# EAGLE design Infinity Mirror_005 (EAGLE 7.3.0)
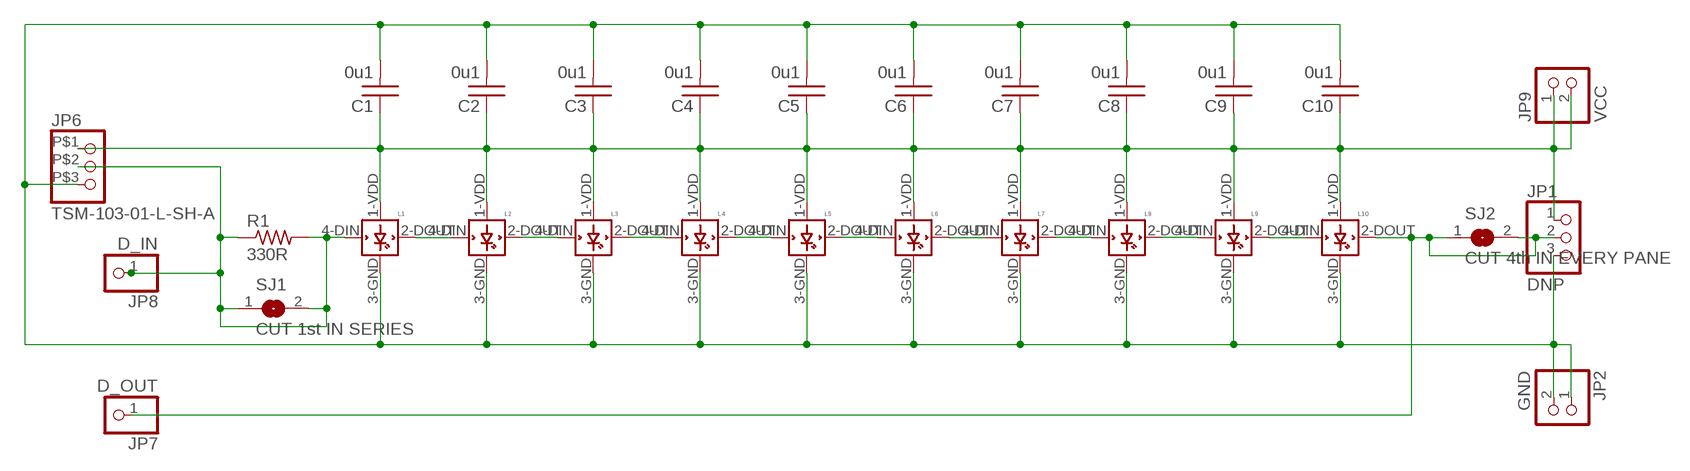
[diagram p0: schematic, sheet 1]

## Parts
C1  0u1  C-USC1206  [C1206]
C2  0u1  C-USC1206  [C1206]
C3  0u1  C-USC1206  [C1206]
C4  0u1  C-USC1206  [C1206]
C5  0u1  C-USC1206  [C1206]
C6  0u1  C-USC1206  [C1206]
C7  0u1  C-USC1206  [C1206]
C8  0u1  C-USC1206  [C1206]
C9  0u1  C-USC1206  [C1206]
C10  0u1  C-USC1206  [C1206]
JP1  DNP  PINHD-1X3CB  [1X03-CLEANBIG]
JP2  GND  PINHD-1X2  [1X02-CLEANBIG]
JP6  TSM-103-01-L-SH-A  [TSM-103-01-L-SH-A]
JP7  D_OUT  PINHD-1X1CB  [1X01-CLEANBIG]
JP8  D_IN  PINHD-1X1CB  [1X01-CLEANBIG]
JP9  VCC  PINHD-1X2  [1X02-CLEANBIG]
L1  WS2812B  [WS2812B]
L2  WS2812B  [WS2812B]
L3  WS2812B  [WS2812B]
L4  WS2812B  [WS2812B]
L5  WS2812B  [WS2812B]
L6  WS2812B  [WS2812B]
L7  WS2812B  [WS2812B]
L8  WS2812B  [WS2812B]
L9  WS2812B  [WS2812B]
L10  WS2812B  [WS2812B]
R1  330R  R-US_R1206  [R1206]
SJ1  CUT 1st IN SERIES  SJ  [SJ]
SJ2  CUT 4th IN EVERY PANE  SJ  [SJ]

## Nets
GND: C1.2 C2.2 C3.2 C4.2 C5.2 C6.2 C7.2 C8.2 C9.2 C10.2 JP1.3 JP2.1 JP2.2 JP6.P$3 L1.3-GND(GND) L2.3-GND(GND) L3.3-GND(GND) L4.3-GND(GND) L5.3-GND(GND) L6.3-GND(GND) L7.3-GND(GND) L8.3-GND(GND) L9.3-GND(GND) L10.3-GND(GND)
N$1: L2.2-DOUT(DOUT) L3.4-DIN(DIN)
N$2: L3.2-DOUT(DOUT) L4.4-DIN(DIN)
N$3: L4.2-DOUT(DOUT) L5.4-DIN(DIN)
N$4: L5.2-DOUT(DOUT) L6.4-DIN(DIN)
N$5: L6.2-DOUT(DOUT) L7.4-DIN(DIN)
N$6: L1.2-DOUT(DOUT) L2.4-DIN(DIN)
N$7: L7.2-DOUT(DOUT) L8.4-DIN(DIN)
N$8: L8.2-DOUT(DOUT) L9.4-DIN(DIN)
N$10: JP6.P$2 JP8.1 L1.4-DIN(DIN) R1.1 R1.2 SJ1.1 SJ1.2
N$12: L9.2-DOUT(DOUT) L10.4-DIN(DIN)
N$14: JP1.2 JP7.1 L10.2-DOUT(DOUT) SJ2.1 SJ2.2
VCC: C1.1 C2.1 C3.1 C4.1 C5.1 C6.1 C7.1 C8.1 C9.1 C10.1 JP1.1 JP6.P$1 JP9.1 JP9.2 L1.1-VDD(VDD) L2.1-VDD(VDD) L3.1-VDD(VDD) L4.1-VDD(VDD) L5.1-VDD(VDD) L6.1-VDD(VDD) L7.1-VDD(VDD) L8.1-VDD(VDD) L9.1-VDD(VDD) L10.1-VDD(VDD)

## Library data of the parts
C1-C10 = adafruit:C-US: CAPACITOR, American symbol
JP1 = adafruit:PINHD-1X3: PIN HEADER
JP2 JP9 = adafruit:PINHD-1X2
JP6 = AAA_Custom_Parts:TSM-103-01-L-SH-A
JP7 JP8 = adafruit:PINHD-1X1: Pin header 1x1 for 0.1" spacing With round pins
L1-L10 = adafruit:WS2812B
R1 = resistor:R-US_: RESISTOR, American symbol
SJ1 SJ2 = jumper:SJ: SMD solder JUMPER

## Board
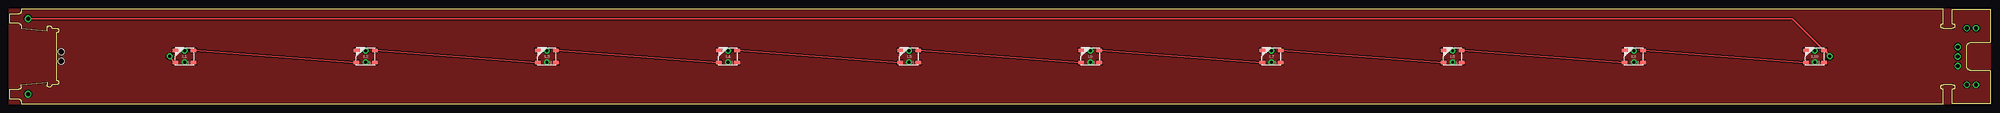
[diagram p1: board, top side]
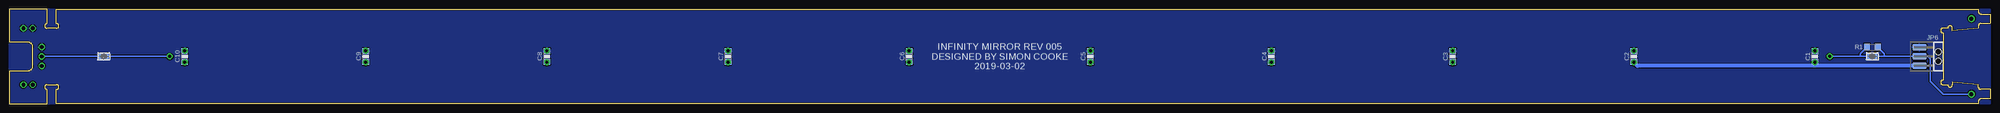
[diagram p2: board, bottom side, seen from below]

Size 533.4 x 25.4 mm. Coordinates in mm from the lower left corner, seen from the top.
Outline: 523.24,3.83 arc180 523.24,5.11 520.7,5.11 arc180 520.7,3.83 520.7,0 3.17,0 3.17,0.64 arc90 2.54,1.27 0,1.27 0,3.81 2.54,3.81 arc90 3.17,4.45 3.17,5.08 10.16,5.71 10.16,5.08 arc180 11.43,5.08 12.7,5.08 arc180 12.7,6.35 12.7,19.05 arc180 12.7,20.32 11.43,20.32 arc180 10.16,20.32 10.16,19.68 3.17,20.32 3.17,20.95 arc90 2.54,21.59 0,21.59 0,24.13 2.54,24.13 arc90 3.17,24.77 3.17,25.4 520.7,25.4 520.7,21.57 arc180 520.7,20.3 523.24,20.3 arc180 523.24,21.57 523.24,25.4 533.4,25.4 533.4,16.51 528.32,16.51 arc90 527.05,15.24 527.05,10.16 arc90 528.32,8.89 533.4,8.89 533.4,0 523.24,0 523.24,3.81
Copper layers (1*16): Top 0.035mm / dielectric 1.5mm / Bottom 0.035mm
Design rules "default *": minimum track width 10mil, minimum drill 30mil, track to track 8mil, track to pad 8mil, pad to pad 8mil, via to via 8mil, smd to smd 8mil, copper to edge 10mil, drill to drill 10mil, minimum pad ring 10mil, minimum via ring 8mil, stop-mask expansion 4mil, vias tented up to drill 100mil, thermal gap 10mil

### Footprints (pad centres in the part's own frame; a part is rotated, then mirrored left to right if it is on the bottom)
C1206 = smd 1.6 x 1.8: 1 -1.4,0; 2 1.4,0
1X03-CLEANBIG = drill 1.016 pad 1.676: 1 -2.54,0; 2 0,0; 3 2.54,0
1X02-CLEANBIG = drill 1.016 pad 1.676: 1 -2.54,0; 2 0,0
TSM-103-01-L-SH-A = smd 3.81 x 1.778: P$1 -3.81,-2.54; P$2 -3.81,0; P$3 -3.81,2.54 | hole 1.6: 1.27,1.27; 1.27,-1.27
1X01-CLEANBIG = drill 1.016 pad 1.778: 1 0,0
WS2812B = smd 1.5 x 0.9: 1-VDD 2.45,-1.65; 2-DOUT 2.45,1.65; 3-GND -2.45,1.65; 4-DIN -2.45,-1.65
R1206 = smd 1.6 x 1.803: 1 -1.422,0; 2 1.422,0
SJ = smd 1.168 x 1.6: 1 -0.762,0; 2 0.762,0

### Placement (x,y rotation side)
C1  47.19,12.7 90 bottom
C2  95.96,12.7 90 bottom
C3  144.75,12.7 90 bottom
C4  193.52,12.7 90 bottom
C5  242.32,12.7 90 bottom
C6  291.08,12.7 90 bottom
C7  339.88,12.7 90 bottom
C8  388.65,12.7 90 bottom
C9  437.44,12.7 90 bottom
C10  486.21,12.7 90 bottom
JP1  524.64,12.7 90 top
JP2  529.59,20.32 0 top
JP6  15.24,12.7 0 bottom
JP7  5.08,22.86 0 top
JP8  5.08,2.54 0 top
JP9  529.59,5.08 0 top
L1  47.19,12.7 0 top
L2  95.96,12.7 0 top
L3  144.75,12.7 0 top
L4  193.52,12.7 0 top
L5  242.32,12.7 0 top
L6  291.08,12.7 0 top
L7  339.88,12.7 0 top
L8  388.65,12.7 0 top
L9  437.44,12.7 0 top
L10  486.21,12.7 0 top
R1  31.75,15.24 180 bottom
SJ1  31.75,12.7 180 bottom
SJ2  508,12.7 180 bottom

### Tracks (layer width: path | path; a pad name or v marks a point on that pad's centre or on a via)
GND  (via drill 0.8)
  Top 0.813: L9.3-GND v437.44,14.29 | L7.3-GND v339.88,14.29 | L6.3-GND v291.08,14.29 | L5.3-GND v242.32,14.29 | L4.3-GND v193.52,14.29 | L3.3-GND v144.75,14.29 | L2.3-GND v95.96,14.29 | L8.3-GND v388.64,14.29 | v47.19,14.29 L1.3-GND | L10.3-GND v486.21,14.29
  pour Bottom (isolate 0.254): 0,25.4 533.4,25.4 533.4,0 0,0
N$1
  Top 0.406: L2.2-DOUT L3.4-DIN
N$2
  Top 0.406: L3.2-DOUT L4.4-DIN
N$3
  Top 0.406: L4.2-DOUT L5.4-DIN
N$4
  Top 0.406: L5.2-DOUT L6.4-DIN
N$5
  Top 0.406: L6.2-DOUT L7.4-DIN
N$6
  Top 0.406: L1.2-DOUT L2.4-DIN
N$7
  Top 0.406: L7.2-DOUT L8.4-DIN
N$8
  Top 0.406: L8.2-DOUT L9.4-DIN
N$10  (via drill 0.8)
  Top 0.406: v43.18,12.7 44.13,11.43 L1.4-DIN
  Bottom 0.406: JP8.1 12.7,2.54 16.19,6.03 16.19,12.06 16.83,12.7 JP6.P$2 28.57,12.7 | 28.57,12.7 SJ1.1 SJ1.2 34.92,12.7 | 34.92,12.7 v43.18,12.7 | R1.1 28.57,13.49 28.57,12.7 | R1.2 34.92,13.49 34.92,12.7
N$12
  Top 0.406: L9.2-DOUT L10.4-DIN
N$14  (via drill 0.8)
  Top 0.406: JP7.1 480.06,22.86 488.57,14.35 L10.2-DOUT 489.27,13.97 v490.22,12.7
  Bottom 0.406: v490.22,12.7 SJ2.1 SJ2.2 JP1.2
VCC  (via drill 0.8)
  Bottom 0.813: C8.1 v388.64,11.11 | v437.44,11.11 C9.1 | C10.1 v486.21,11.11 | C7.1 v339.88,11.11 | C1.1 v47.19,11.11 | C2.1 v95.96,11.11 | C3.1 v144.75,11.11 | C4.1 v193.52,11.11 | C5.1 v242.32,11.11 | C6.1 v291.08,11.11
  Bottom 1.016: JP6.P$1 95.01,10.16 v95.96,11.11
  pour Top (isolate 0.254): 0,25.4 533.4,25.4 533.4,0 0,0

### Text on the board
bPlace: INFINITY MIRROR REV 005 / DESIGNED BY SIMON COOKE / 2019-03-02